# Altium schematic sheet AwesomeRemote.SchDoc
size A
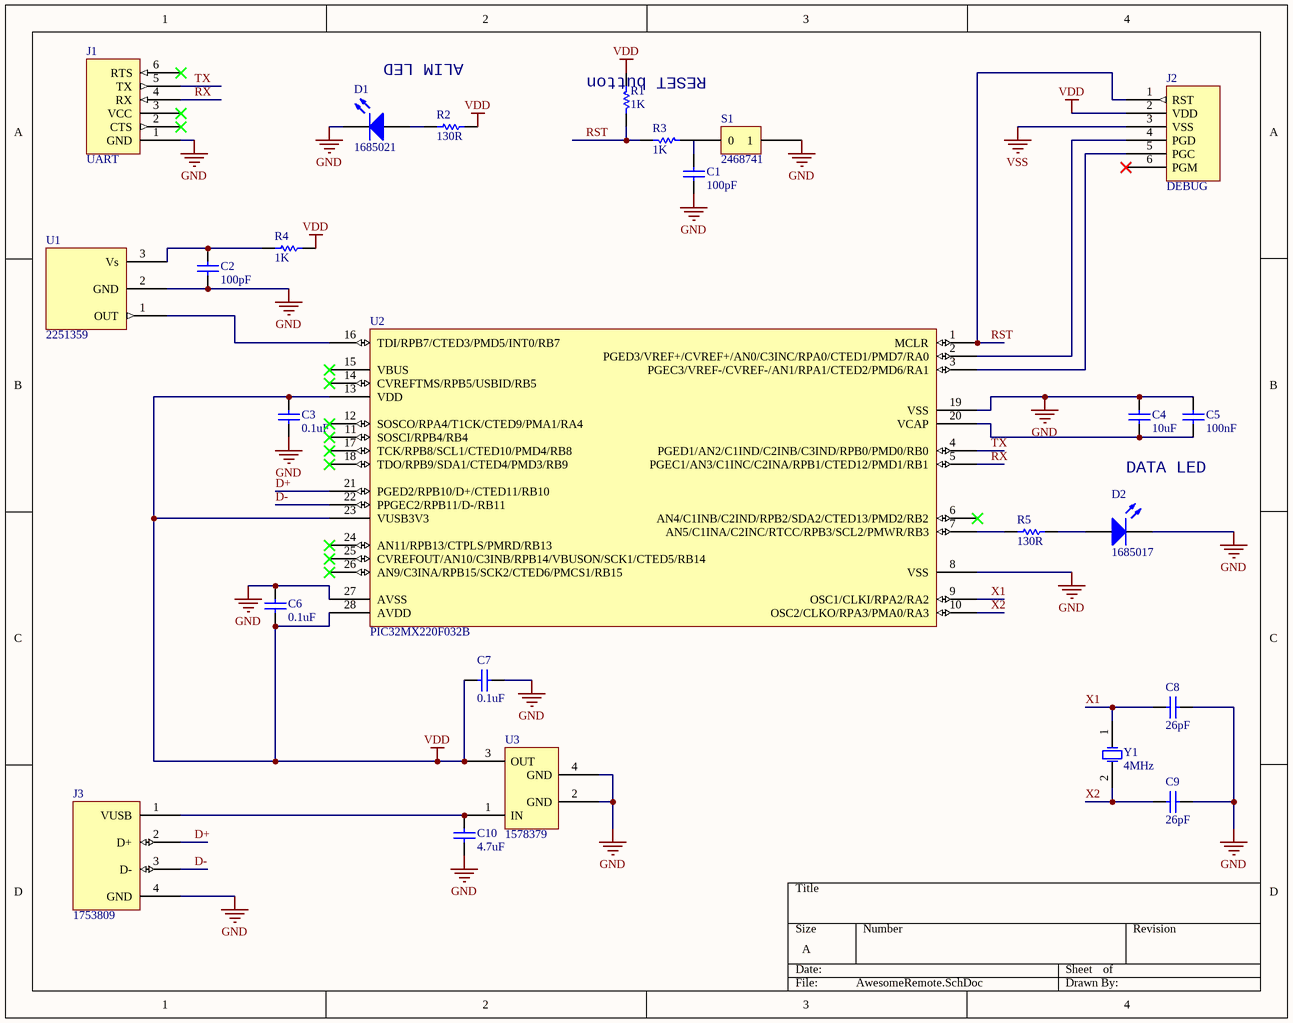
[diagram p0: AwesomeRemote.SchDoc]

## Parts
C1  100pF  [CAPC1608N]
C2  100pF  [CAPC1608N]
C3  0.1uF  [CAPC1608N]
C4  10uF  [CAPC1608N]
C5  100nF  [CAPC1608N]
C6  0.1uF  [CAPC1608N]
C7  0.1uF  [CAPC1608N]
C8  26pF  [CAPC1608N]
C9  26pF  [CAPC1608N]
C10  4.7uF  [CAPC1608N]
D1  1685021  [LED]
D2  1685017  [LED]
J1  UART  [6-pins]
J2  DEBUG  [6-pins]
J3  1753809  [USB_B_FEM]
R1  1K  [CAPC1608N]
R2  130R  [CAPC1608N]
R3  1K  [CAPC1608N]
R4  1K  [CAPC1608N]
R5  130R  [CAPC1608N]
S1  2468741  [PUSH_BUTTON]
U1  2251359  [TSOP38238]
U2  PIC32MX220F032B  [PIC32MX220]
U3  1578379  [LDO_REG]
Y1  4MHz  [XTAL139X50X45]

## Nets
GND: C1.1 C2.1 C3.2 C4.1 C5.1 C6.1 C7.2 C8.2 C9.2 C10.1 D1.2(K) D2.2(K) J1.1(GND) J3.4(GND) S1.1 U1.2(GND) U2.8(VSS) U2.19(VSS) U2.27(AVSS) U3.2(GND) U3.4(GND)
VDD: C3.1 C6.2 C7.1 J2.2(VDD) R1.2 R2.2 R4.2 U2.13(VDD) U2.23(VUSB3V3) U2.28(AVDD) U3.3(OUT)
VSS: J2.3(VSS)
D+: J3.2(D+) U2.21(PGED2/RPB10/D+/CTED11/RB10)
D-: J3.3(D-) U2.22(PPGEC2/RPB11/D-/RB11)
RST: J2.1(RST) R1.1 R3.2 U2.1(MCLR)
RX: J1.4(RX) U2.5(PGEC1/AN3/C1INC/C2INA/RPB1/CTED12/PMD1/RB1)
TX: J1.5(TX) U2.4(PGED1/AN2/C1IND/C2INB/C3IND/RPB0/PMD0/RB0)
X1: C8.1 U2.9(OSC1/CLKI/RPA2/RA2) Y1.1(OSC1)
X2: C9.1 U2.10(OSC2/CLKO/RPA3/PMA0/RA3) Y1.2(OSC2)
NetC1_2: C1.2 R3.1
NetC2_2: C2.2 R4.1 U1.3(Vs)
NetC4_2: C4.2 C5.2 U2.20(VCAP)
NetC10_2: C10.2 J3.1(VUSB) U3.1(IN)
NetD1_1: D1.1(A) R2.1
NetD2_1: D2.1(A) R5.2
NetJ2_4: J2.4(PGD) U2.2(PGED3/VREF+/CVREF+/AN0/C3INC/RPA0/CTED1/PMD7/RA0)
NetJ2_5: J2.5(PGC) U2.3(PGEC3/VREF-/CVREF-/AN1/RPA1/CTED2/PMD6/RA1)
NetR5_1: R5.1 U2.7(AN5/C1INA/C2INC/RTCC/RPB3/SCL2/PMWR/RB3)
NetU1_1: U1.1(OUT) U2.16(TDI/RPB7/CTED3/PMD5/INT0/RB7)

Not connected (* = marked no-connect by the designer): J1 2(CTS)* 3(VCC)* 6(RTS)*; J2 6(PGM)*; S1 0; U2 6(AN4/C1INB/C2IND/RPB2/SDA2/CTED13/PMD2/RB2)* 11(SOSCI/RPB4/RB4)* 12(SOSCO/RPA4/T1CK/CTED9/PMA1/RA4)* 14(CVREFTMS/RPB5/USBID/RB5)* 15(VBUS)* 17(TCK/RPB8/SCL1/CTED10/PMD4/RB8)* 18(TDO/RPB9/SDA1/CTED4/PMD3/RB9)* 24(AN11/RPB13/CTPLS/PMRD/RB13)* 25(CVREFOUT/AN10/C3INB/RPB14/VBUSON/SCK1/CTED5/RB14)* 26(AN9/C3INA/RPB15/SCK2/CTED6/PMCS1/RB15)*

## Notes on the sheet
- ALIM LED
- RESET button
- DATA LED

## Library data of the parts
C1-C10 = Cap: Capacitor; Published: 8-Jun-2000; LatestRevisionDate: 17-Jul-2002; LatestRevisionNote: Re-released for DXP Platform.; PackageReference: RAD-0.3; Publisher: Altium Limited; PackageDescription: Radial Cap, Thru-Hole; 2 Leads; 0.3 in Pin Spacing
  C1 C2: Value: 100pF
  C3 C6 C7: Value: 0.1uF
  C4: Value: 10uF
  C5: Value: 100nF
  C8 C9: Value: 26pF
  C10: Value: 4.7uF
D1 = LED0: Typical INFRARED GaAs LED; Fabricant: ROHM; Fournisseur: Farnell; RefFabricant: SLR-342VR3FP; Published: 8-Jun-2000; LatestRevisionDate: 08-Jul-2005; LatestRevisionNote: Mech Layer 1 removed.; PackageReference: LED-0; Publisher: Altium Limited; PackageDescription: LED; 2 Leads; RefFournisseur: 1685021
D2 = LED0: Typical INFRARED GaAs LED; Fabricant: ROHM; Fournisseur: Farnell; RefFabricant: SLR-342MG3FP; Published: 8-Jun-2000; LatestRevisionDate: 08-Jul-2005; LatestRevisionNote: Mech Layer 1 removed.; PackageReference: LED-0; Publisher: Altium Limited; PackageDescription: LED; 2 Leads; RefFournisseur: 1685017
J1 = CON6
J2 = ICD3_CON: Fournisseur: Farnell
J3 = USB_CON: USB_fem_2.0; Fournisseur: Farnell; Fabricant: SAMTEC; RefFabricant: USBR‐B‐S‐S‐O‐TH; RefFournisseur: 1753809
R1-R5 = Res1: Resistor; Published: 8-Jun-2000; LatestRevisionDate: 17-Jul-2002; LatestRevisionNote: Re-released for DXP Platform.; PackageReference: AXIAL-0.3; Publisher: Altium Limited; PackageDescription: Axial Device, Thru-Hole; 2 Leads; 0.3 in Pin Spacing
  R1 R3 R4: Value: 1K
  R2 R5: Value: 130R
S1 = PUSH_BUT: Fabricant: TE CONNECTIVITY / ALCOSWITCH; Fournisseur: Farnell; RefFabricant: 1437566-3; RefFournisseur: 2468741
U1 = TSOP38238: IR Receiver; Fabricant: Vishay; Fournisseur: Farnell; RefFabricant: TSOP38238; RefFournisseur: 2251359
U2 = PIC32MX220F032B: Fabricant: Microchip; Fournisseur: Farnell; RefFabricant: PIC32MX220F032B-I/SO; RefFournisseur: 2057069
U3 = VOLTAGE_REG: Fabricant: Microchip; Fournisseur: Farnell; RefFabricant: MCP1824ST‐3302E/DB; RefFournisseur: 1578379
Y1 = XTAL: Crystal Oscillator; Fabricant: CITIZEN FINETECH MIYOTA; Fournisseur: Farnell; RefFabricant: HCM49 4.000MABJ-UT; RefFournisseur: 1611739; Published: 8-Jun-2000; LatestRevisionDate: 17-Jul-2002; LatestRevisionNote: Re-released for DXP Platform.; PackageReference: R38; Publisher: Altium Limited; PackageDescription: Crystal, Thru-Hole; 2 Leads; Body 3.1 x 8.2 mm (Dia.xH); Value: 4MHz